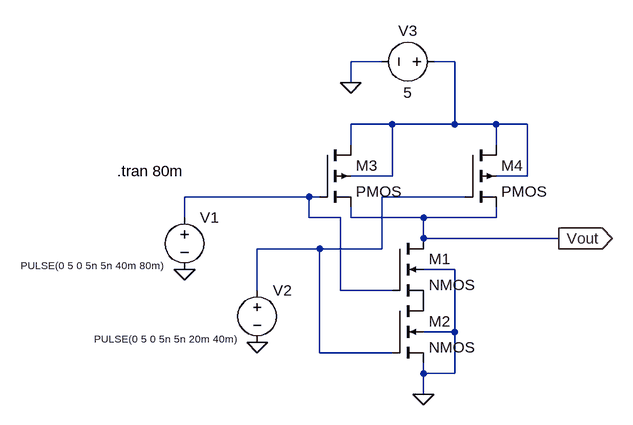
[diagram p0: schematic CMOS NAND.asc]
CMOS NAND.asc, the LTspice schematic file:
Version 4
SHEET 1 880 680
WIRE 128 -160 80 -160
WIRE 240 -160 208 -160
WIRE 80 -128 80 -160
WIRE 144 -64 80 -64
WIRE 240 -64 240 -160
WIRE 240 -64 144 -64
WIRE 304 -64 240 -64
WIRE 352 -64 304 -64
WIRE 80 -32 80 -64
WIRE 304 -32 304 -64
WIRE 144 16 144 -64
WIRE 144 16 80 16
WIRE 352 16 352 -64
WIRE 352 16 304 16
WIRE 16 48 -176 48
WIRE 32 48 16 48
WIRE 256 48 128 48
WIRE -176 80 -176 48
WIRE 16 80 16 48
WIRE 64 80 16 80
WIRE 80 80 80 64
WIRE 192 80 80 80
WIRE 304 80 304 64
WIRE 304 80 192 80
WIRE 192 112 192 80
WIRE 400 112 192 112
WIRE 32 128 -64 128
WIRE 128 128 128 48
WIRE 128 128 32 128
WIRE 240 160 192 160
WIRE -64 192 -64 128
WIRE 64 192 64 80
WIRE 144 192 64 192
WIRE 240 256 240 160
WIRE 240 256 192 256
WIRE 32 288 32 128
WIRE 144 288 32 288
WIRE 192 320 192 304
WIRE 240 320 240 256
WIRE 240 320 192 320
WIRE 192 352 192 320
FLAG -64 272 0
FLAG -176 160 0
FLAG 192 352 0
FLAG 80 -128 0
FLAG 400 112 Vout
IOPIN 400 112 Out
SYMBOL nmos4 144 112 R0
SYMATTR InstName M1
SYMBOL nmos4 144 208 R0
SYMATTR InstName M2
SYMBOL pmos4 32 -32 R0
SYMATTR InstName M3
SYMBOL pmos4 256 -32 R0
SYMATTR InstName M4
SYMBOL voltage -176 64 R0
WINDOW 3 -252 90 Left 1
WINDOW 123 0 0 Left 0
WINDOW 39 0 0 Left 0
SYMATTR InstName V1
SYMATTR Value PULSE(0 5 0 5n 5n 40m 80m)
SYMBOL voltage -64 176 R0
WINDOW 3 -251 91 Left 1
WINDOW 123 0 0 Left 0
WINDOW 39 0 0 Left 0
SYMATTR InstName V2
SYMATTR Value PULSE(0 5 0 5n 5n 20m 40m)
SYMBOL voltage 224 -160 R90
WINDOW 0 -32 56 VBottom 2
WINDOW 3 32 56 VTop 2
WINDOW 123 0 0 Left 0
WINDOW 39 0 0 Left 0
SYMATTR InstName V3
SYMATTR Value 5
TEXT -280 8 Left 2 !.tran 80m

The netlist it stands for:
* CMOS NAND.asc
M1 Vout N002 P001 0 NMOS
M2 P001 N003 0 0 NMOS
M3 N001 N002 Vout N001 PMOS
M4 N001 N003 Vout N001 PMOS
V1 N002 0 PULSE(0 5 0 5n 5n 40m 80m)
V2 N003 0 PULSE(0 5 0 5n 5n 20m 40m)
V3 N001 0 5
.model NMOS NMOS
.model PMOS PMOS
.lib standard.mos
.tran 80m
.backanno
.end